# EAGLE design ライン_左 (EAGLE 9.6.2)
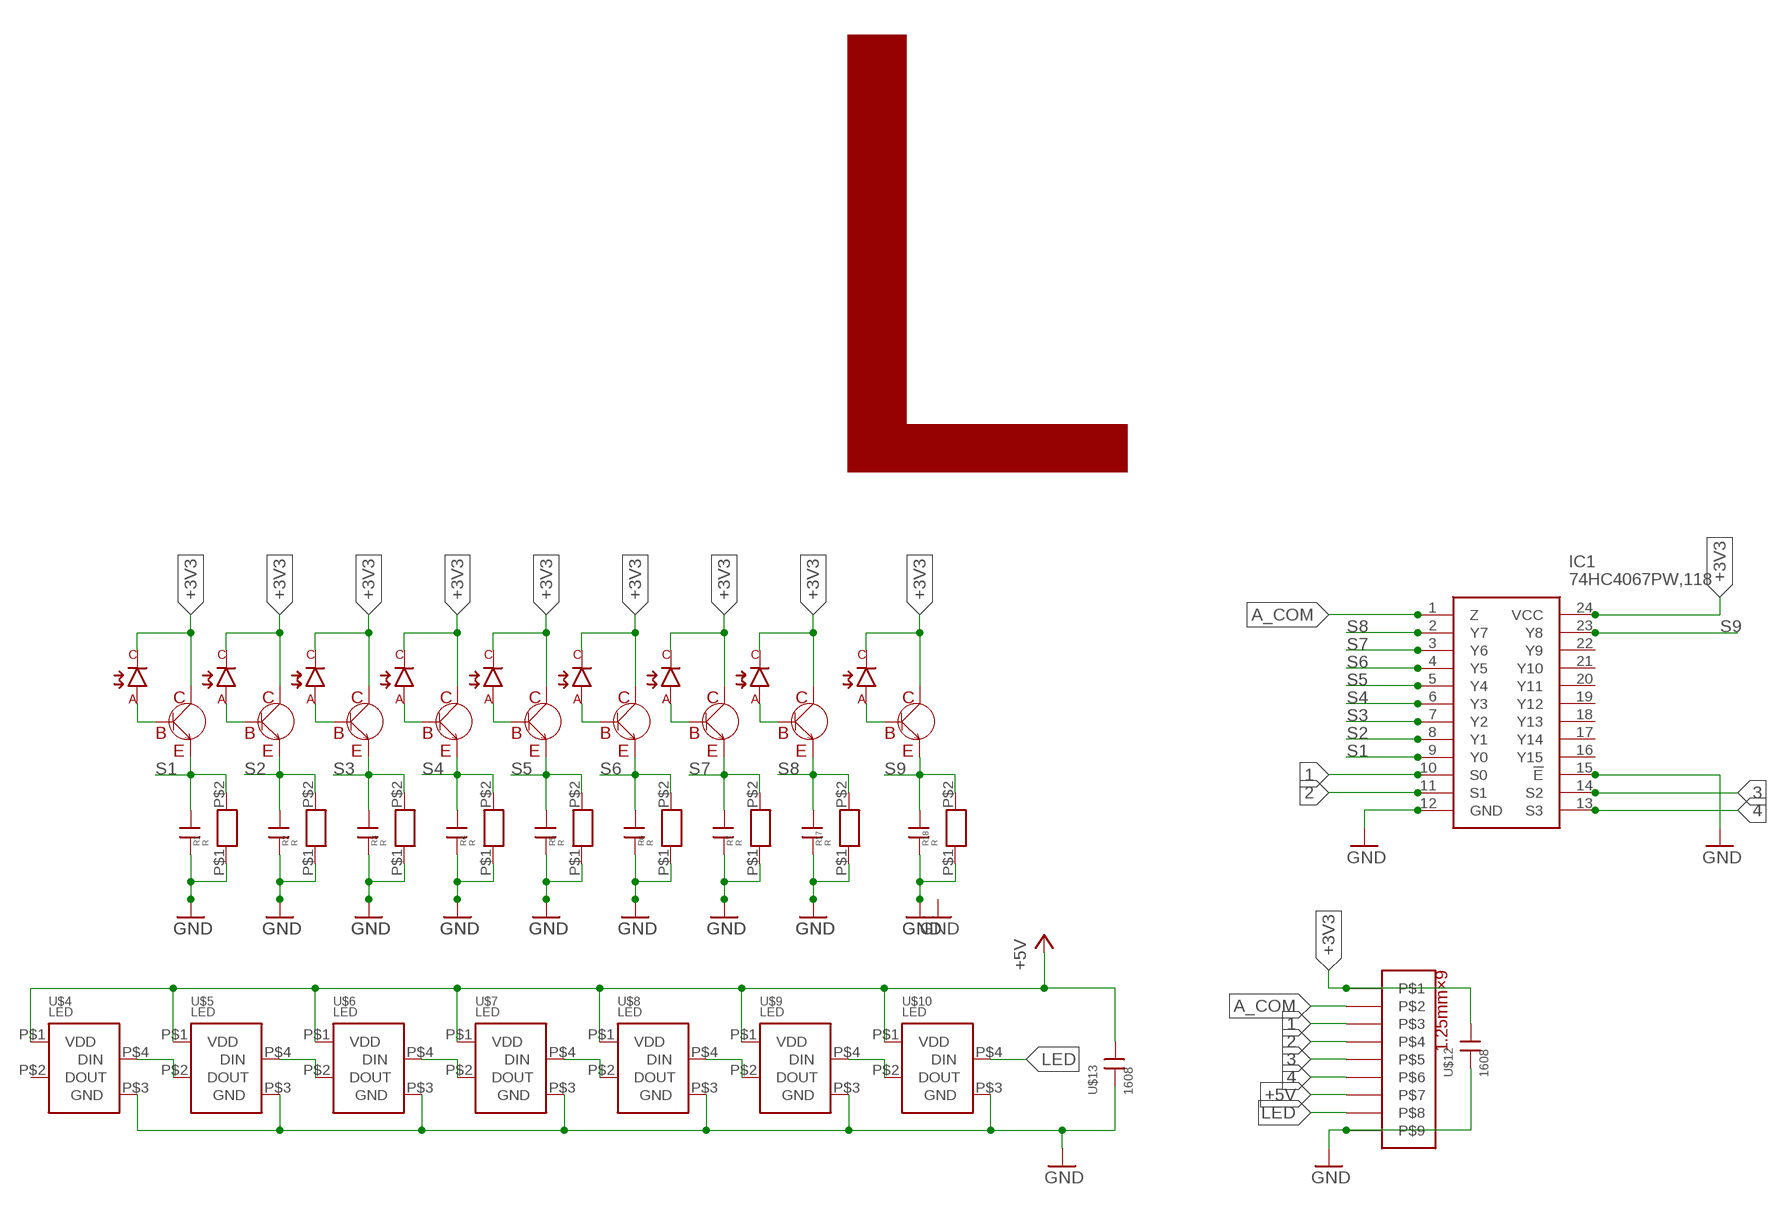
[diagram p0: schematic, sheet 1]

## Parts
C1  1608  [CON]
C2  1608  [CON]
C3  1608  [CON]
C4  1608  [CON]
C5  1608  [CON]
C6  1608  [CON]
C7  1608  [CON]
C17  1608  [CON]
C18  1608  [CON]
IC1  74HC4067PW,118  [SOP65P640X110-24N]
R1  R  [1608]
R2  R  [1608]
R3  R  [1608]
R4  R  [1608]
R5  R  [1608]
R6  R  [1608]
R7  R  [1608]
R17  R  [1608]
R18  R  [1608]
U$4  LED  [LED]
U$5  LED  [LED]
U$6  LED  [LED]
U$7  LED  [LED]
U$8  LED  [LED]
U$9  LED  [LED]
U$10  LED  [LED]
U$11  1MMCON  [1MMCON]
U$12  1608  [CON]
U$13  1608  [CON]
U$14  2CS2712  [TRANS_SSM3J325F,LF]
U$15  フォトダイオード  [フォトダイオード]
U$16  2CS2712  [TRANS_SSM3J325F,LF]
U$17  フォトダイオード  [フォトダイオード]
U$18  2CS2712  [TRANS_SSM3J325F,LF]
U$19  フォトダイオード  [フォトダイオード]
U$20  2CS2712  [TRANS_SSM3J325F,LF]
U$21  フォトダイオード  [フォトダイオード]
U$22  2CS2712  [TRANS_SSM3J325F,LF]
U$23  フォトダイオード  [フォトダイオード]
U$24  2CS2712  [TRANS_SSM3J325F,LF]
U$25  フォトダイオード  [フォトダイオード]
U$26  2CS2712  [TRANS_SSM3J325F,LF]
U$27  フォトダイオード  [フォトダイオード]
U$28  2CS2712  [TRANS_SSM3J325F,LF]
U$29  フォトダイオード  [フォトダイオード]
U$30  2CS2712  [TRANS_SSM3J325F,LF]
U$31  フォトダイオード  [フォトダイオード]

## Nets
1: IC1.10(S0) U$11.P$3
2: IC1.11(S1) U$11.P$4
3: IC1.14(S2) U$11.P$5
4: IC1.13(S3) U$11.P$6
+3V3 [New Class]: IC1.24(VCC) U$11.P$1 U$12.P$1 U$14.C U$15.C U$16.C U$17.C U$18.C U$19.C U$20.C U$21.C U$22.C U$23.C U$24.C U$25.C U$26.C U$27.C U$28.C U$29.C U$30.C U$31.C
+5V [New Class]: U$4.P$1(VDD) U$5.P$1(VDD) U$6.P$1(VDD) U$7.P$1(VDD) U$8.P$1(VDD) U$9.P$1(VDD) U$10.P$1(VDD) U$11.P$7 U$13.P$1
A_COM: IC1.1(Z) U$11.P$2
GND [New Class]: C1.P$2 C2.P$2 C3.P$2 C4.P$2 C5.P$2 C6.P$2 C7.P$2 C17.P$2 C18.P$2 IC1.12(GND) IC1.15(!E) R1.P$1 R2.P$1 R3.P$1 R4.P$1 R5.P$1 R6.P$1 R7.P$1 R17.P$1 R18.P$1 U$4.P$3(GND) U$5.P$3(GND) U$6.P$3(GND) U$7.P$3(GND) U$8.P$3(GND) U$9.P$3(GND) U$10.P$3(GND) U$11.P$9 U$12.P$2 U$13.P$2
LED: U$10.P$4(DIN) U$11.P$8
N$2: U$4.P$4(DIN) U$5.P$2(DOUT)
N$3: U$7.P$4(DIN) U$8.P$2(DOUT)
N$4: U$8.P$4(DIN) U$9.P$2(DOUT)
N$5: U$9.P$4(DIN) U$10.P$2(DOUT)
N$6: U$5.P$4(DIN) U$6.P$2(DOUT)
N$7: U$6.P$4(DIN) U$7.P$2(DOUT)
N$8: U$14.B U$15.A
N$9: U$16.B U$17.A
N$10: U$18.B U$19.A
N$11: U$20.B U$21.A
N$12: U$22.B U$23.A
N$13: U$24.B U$25.A
N$14: U$26.B U$27.A
N$15: U$28.B U$29.A
N$16: U$30.B U$31.A
S1: C1.P$1 IC1.9(Y0) R1.P$2 U$14.E
S2: C2.P$1 IC1.8(Y1) R2.P$2 U$16.E
S3: C3.P$1 IC1.7(Y2) R3.P$2 U$18.E
S4: C4.P$1 IC1.6(Y3) R4.P$2 U$20.E
S5: C5.P$1 IC1.5(Y4) R5.P$2 U$22.E
S6: C6.P$1 IC1.4(Y5) R6.P$2 U$24.E
S7: C7.P$1 IC1.3(Y6) R7.P$2 U$26.E
S8: C17.P$1 IC1.2(Y7) R17.P$2 U$28.E
S9: C18.P$1 IC1.23(Y8) R18.P$2 U$30.E
Unconnected: IC1.16(Y15) IC1.17(Y14) IC1.18(Y13) IC1.19(Y12) IC1.20(Y11) IC1.21(Y10) IC1.22(Y9) U$4.P$2(DOUT)

## Notes on the sheet
- L

## Library data of the parts
C1-C7 C17 C18 U$12 U$13 = con1608:1608
IC1 = 16ch MUX:74HC4067PW,118: 74HC(T)4067 - 16-channel analog multiplexer/demultiplexer@en-us Source: Datasheet <https://assets.nexperia.com/documents/data-sheet/74HC_HCT4067.pdf>; DESCRIPTION: 74HC(T)4067 - 16-channel analog multiplexer/demultiplexer@en-us; HEIGHT: 1.1mm; MANUFACTURER_NAME: Nexperia; MANUFACTURER_PART_NUMBER: 74HC4067PW,118; MOUSER_PART_NUMBER: 771-74HC4067PW-T; MOUSER_PRICE-STOCK: https://www.mouser.co.uk/ProductDetail/Nexperia/74HC4067PW118?qs=P62ublwmbi9BArRi%252BuDUjA%3D%3D
R1-R7 R17 R18 = R 1608:R
U$4-U$10 = フルカラーLED:LED
U$11 = 9P_1.25mmCON:1MMCON
U$14 U$16 U$18 U$20 U$22 U$24 U$26 U$28 U$30 = 2CS2712:2CS2712
U$15 U$17 U$19 U$21 U$23 U$25 U$27 U$29 U$31 = フォトダイオード:フォトダイオード

## Net classes
1 New Class: width 0.254 mm

## Board
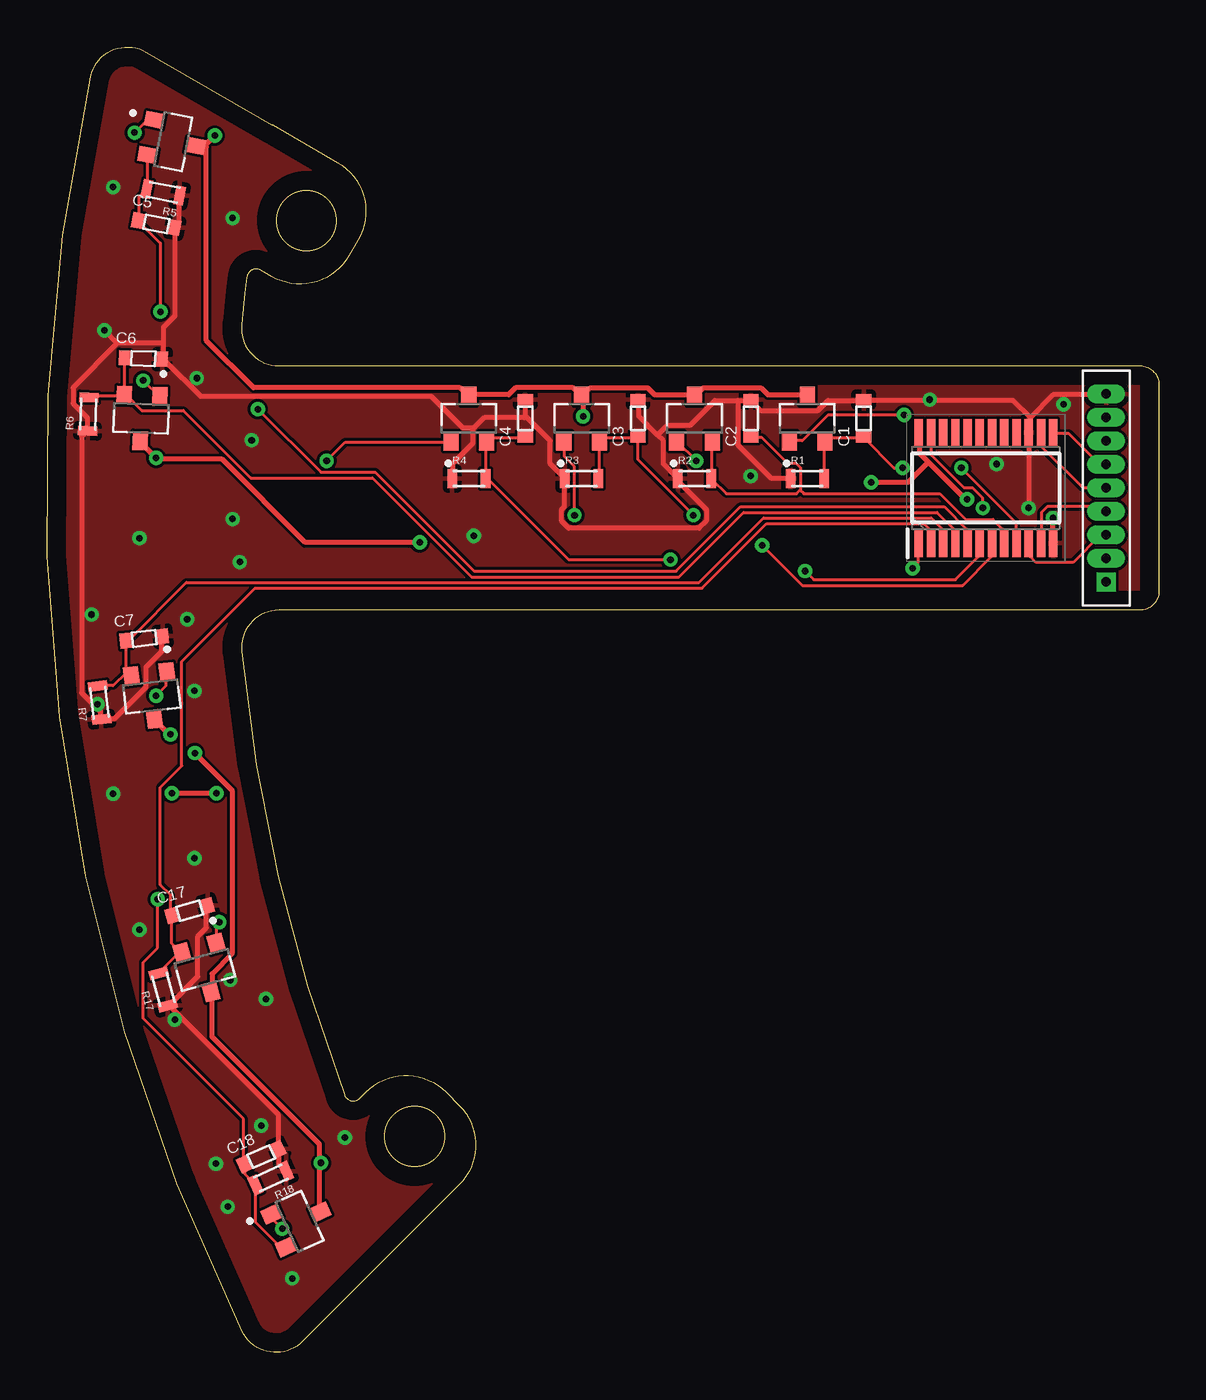
[diagram p1: board, top side]
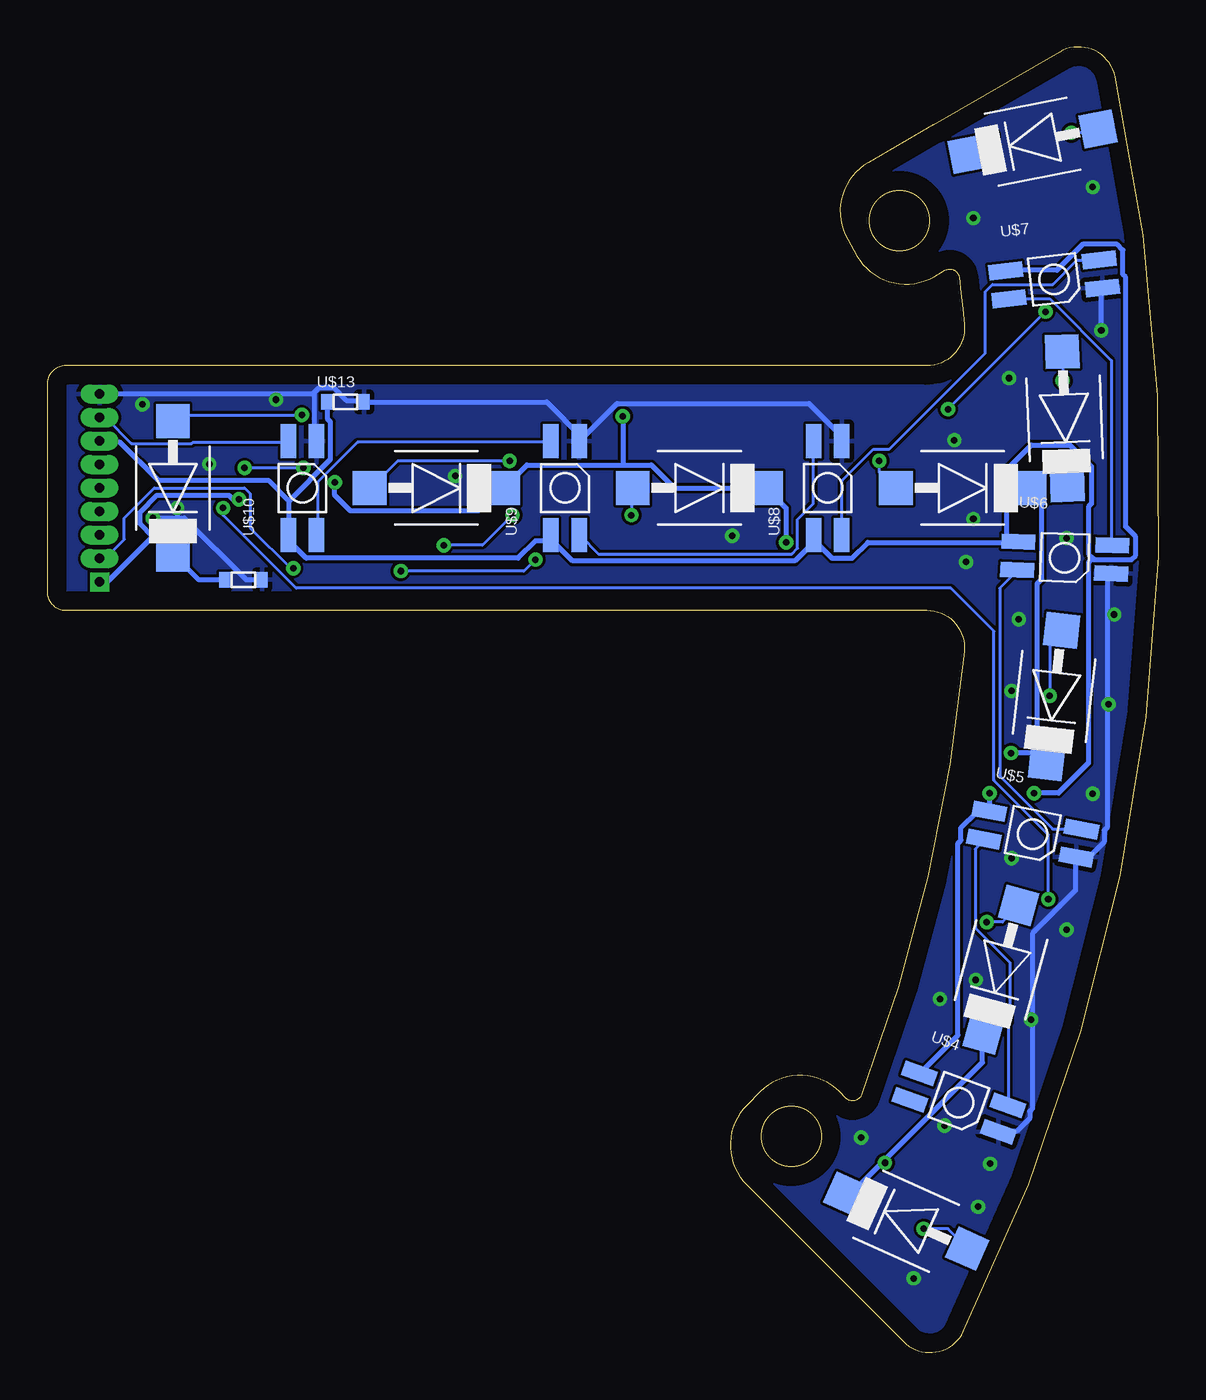
[diagram p2: board, bottom side, seen from below]

Size 59.13 x 69.43 mm. Coordinates in mm from the lower left corner, seen from the top.
Outline: 15.46,63.28 arc-90 16.55,59.18 16.05,58.32 arc-90 11.95,57.22 11.37,57.56 arc113 10.62,57.19 arc2 10.35,54.67 arc95 12.34,52.48 58.13,52.48 arc-90 59.13,51.48 59.13,40.48 arc-90 58.13,39.48 12.34,39.48 arc95 10.35,37.29 arc15 15.82,13.7 arc114 16.64,13.52 16.97,13.86 arc-90 21.21,13.86 21.92,13.15 arc-90 21.92,8.91 13.59,0.59 arc-109 10.39,1.12 arc-39 2.32,67.86 arc-108 5.28,69.16 11.99,65.28 arc0 11.99,65.28 15.46,63.28
Outline: circle at 13.79,60.2 radius 1.6
Outline: circle at 19.55,11.49 radius 1.6
Copper layers (1*16): Top 0.035mm / dielectric 1.5mm / Bottom 0.035mm
Design rules "default": minimum track width 6mil, minimum drill 0.35mm, track to track 6mil, track to pad 6mil, pad to pad 6mil, via to via 6mil, smd to smd 6mil, copper to edge 40mil, drill to drill 6mil, minimum pad ring 10mil, minimum via ring 8mil, stop-mask expansion 4mil, vias tented up to drill 0mil, thermal gap 10mil

### Footprints (pad centres in the part's own frame; a part is rotated, then mirrored left to right if it is on the bottom)
CON = smd 0.6 x 0.813: P$1 -1,0; P$2 1,0
SOP65P640X110-24N = smd 1.475 x 0.45: 1 -2.938,3.575; 2 -2.938,2.925; 3 -2.938,2.275; 4 -2.938,1.625; 5 -2.938,0.975; 6 -2.938,0.325; 7 -2.938,-0.325; 8 -2.938,-0.975; 9 -2.938,-1.625; 10 -2.938,-2.275; 11 -2.938,-2.925; 12 -2.938,-3.575; 13 2.938,-3.575; 14 2.938,-2.925; 15 2.938,-2.275; 16 2.938,-1.625; 17 2.938,-0.975; 18 2.938,-0.325; 19 2.938,0.325; 20 2.938,0.975; 21 2.938,1.625; 22 2.938,2.275; 23 2.938,2.925; 24 2.938,3.575
1608 = smd 0.508 x 1.016: P$1 -0.889,0; P$2 0.889,0
LED = smd 1.8 x 0.82: P$1 -2.5,0.75; P$2 -2.5,-0.75; P$3 2.5,-0.75; P$4 2.5,0.75
1MMCON = drill 0.5 square: P$1 0,0 | drill 0.5 long: P$2 1.25,0; P$3 2.5,0; P$4 3.75,0; P$5 5,0; P$6 6.25,0; P$7 7.5,0; P$8 8.75,0; P$9 10,0
TRANS_SSM3J325F,LF = smd 1 x 0.8: B -1.2,0.95; C 1.2,0; E -1.2,-0.95
フォトダイオード = smd 1.8 x 1.8: A -3.55,0; C 3.55,0

### Placement (x,y rotation side)
C1  43.43,49.68 90 top
C2  37.43,49.68 90 top
C3  31.43,49.68 90 top
C4  25.43,49.68 90 top
C5  5.82,60.01 349 top
C6  5.12,52.86 357.8 top
C7  5.17,37.98 6.6 top
C17  7.58,23.5 15.4 top
C18  11.39,10.42 24.2 top
IC1  49.93,45.98 90 top
R1  40.43,46.48 0 top
R2  34.43,46.48 0 top
R3  28.43,46.48 0 top
R4  22.43,46.48 0 top
R5  6.18,61.7 169 top
R6  2.2,49.9 87.8 top
R7  2.79,34.56 96.6 top
R17  6.18,19.31 105.4 top
R18  11.9,9.27 204.2 top
U$4  10.64,13.29 340.2 bottom
U$5  6.71,27.56 349 bottom
U$6  5.01,42.27 357.8 bottom
U$7  5.57,57.07 6.6 bottom
U$8  17.61,45.98 90 bottom
U$9  31.58,45.98 90 bottom
U$10  45.55,45.98 90 bottom
U$11  56.33,40.98 90 top
U$12  48.69,41.1 0 bottom
U$13  43.27,50.56 0 bottom
U$14  40.43,49.68 90 top
U$15  52.43,45.98 270 bottom
U$16  34.43,49.68 90 top
U$17  38.43,45.98 0 bottom
U$18  28.43,49.68 90 top
U$19  24.43,45.98 0 bottom
U$20  22.43,49.68 90 top
U$21  10.43,45.98 0 bottom
U$22  6.72,64.39 349 top
U$23  6.72,64.39 191 bottom
U$24  5.01,49.68 267.8 top
U$25  5.01,49.68 272.2 bottom
U$26  5.57,34.89 276.6 top
U$27  5.57,34.89 263.4 bottom
U$28  8.4,20.35 285.4 top
U$29  8.4,20.35 254.6 bottom
U$30  13.43,6.98 24.2 top
U$31  13.43,6.98 155.8 bottom

### Tracks (layer width: path | path; a pad name or v marks a point on that pad's centre or on a via)
1
  Top 0.152: IC1.10 52.29,43.01 52.29,42.32 52.59,42.02 54.57,42.02 56.02,43.46 56.32,43.46 U$11.P$3
2
  Top 0.152: IC1.11 52.9,43.08 52.9,44.68 53.2,44.99 56.1,44.99 56.32,44.76 U$11.P$4
3
  Top 0.152: U$11.P$5 55.1,45.98 52.9,48.19 52.9,48.87 IC1.14
4
  Top 0.152: IC1.13 53.58,48.87 54.34,48.87 55.94,47.27 56.32,47.27 U$11.P$6
+3V3  (via drill 0.35)
  Top 0.254: 14.49,10.09 14.49,7.5 U$30.C | 14.49,10.09 14.49,11.08 8.78,16.79 8.78,19.16 U$28.C 8.78,19.31 8.78,20.15 9.84,21.21 9.84,29.9 v7.86,31.88 | v14.57,10.09 14.49,10.09 | v6.57,32.87 6.49,32.87 5.73,33.63 U$26.C | U$24.C 4.97,48.42 v5.8,47.58 5.88,47.5 9.31,47.5 13.73,43.08 v19.82,43.08 | 46.88,47.35 48.86,45.37 v48.93,45.37 | 46.88,47.35 46.42,47.81 46.42,48.87 IC1.24 | 8.39,64.19 7.94,64.19 U$22.C | v8.93,64.72 8.39,64.19 | U$18.C 28.36,50.93 27.98,51.31 24.93,51.31 24.55,50.93 22.49,50.93 U$20.C 22.34,50.93 21.96,51.31 10.99,51.31 8.47,53.83 8.47,64.11 8.39,64.19 | U$18.C 28.51,50.93 28.89,51.31 31.94,51.31 32.32,50.93 34.38,50.93 U$16.C 34.53,50.93 34.91,51.31 37.96,51.31 38.34,50.93 40.4,50.93 U$14.C | v28.51,49.79 28.51,50.78 U$18.C | 46.88,47.35 45.81,46.28 v43.83,46.28
  Bottom 0.254: 14.64,10.16 16.32,8.49 16.62,8.49 U$31.C | 14.64,10.16 9.38,15.42 9.38,16.87 U$29.C | v14.57,10.09 14.64,10.16 | 5.8,47.12 v5.8,47.58 | 5.8,47.12 4.89,46.21 U$25.C | 5.8,47.12 5.8,47.04 6.87,45.98 U$21.C 6.79,45.9 6.26,45.37 6.26,41.1 6.49,40.87 6.49,32.95 v6.57,32.87 6.57,31.96 6.03,31.42 U$27.C 6.64,31.88 v7.86,31.88 | U$12.P$1 51.07,41.1 52.36,42.4 U$15.C 52.51,42.4 53.5,43.39 | v48.93,45.37 49.24,45.37 49.47,45.6 53.28,45.6 54.19,44.68 54.19,44.07 53.5,43.39 | 53.5,43.39 55.87,41.02 56.32,41.02 U$11.P$1 | 28.51,47.2 33.62,47.2 34.84,45.98 U$17.C 34.99,45.98 36.21,44.76 42.99,44.76 43.83,45.6 v43.83,46.28 | 28.51,47.2 26.99,47.2 25.77,45.98 U$19.C 20.81,45.9 19.82,44.91 v19.82,43.08 | v8.93,64.72 9.16,64.72 10.15,63.73 U$23.C | v28.51,49.79 28.51,47.2
+5V  (via drill 0.35)
  Top 0.254: v6.64,29.75 v9,29.75
  Bottom 0.254: 46.27,45.29 44.06,47.5 44.06,49.48 44.21,49.64 44.21,50.55 U$13.P$1 | 46.27,45.29 46.27,43.54 U$10.P$1 46.27,43.39 46.27,43.16 45.35,42.24 34.07,42.24 33.16,43.16 32.4,43.16 U$9.P$1 32.32,43.46 32.32,43.23 31.18,42.09 19.37,42.09 18.38,43.08 U$8.P$1 18.3,43.46 18.3,43.16 17.39,42.24 16.32,42.24 15.48,43.08 7.48,43.08 U$6.P$1 8.09,43.16 8.09,46.97 6.79,48.26 4.74,48.26 3.59,47.12 3.59,45.14 3.75,44.99 3.75,42.47 3.52,42.24 | 46.27,45.29 47.33,46.36 53.2,46.36 55.26,48.42 56.32,48.42 U$11.P$7 | U$4.P$1 12.66,14.89 10.68,16.87 10.68,27.08 10.53,27.23 10.53,27.92 9.69,28.76 9.08,28.76 U$5.P$1 9,28.91 v9,29.75 | 3.52,42.24 3.44,42.17 1.46,42.17 1.23,42.4 1.23,43.39 1.76,43.92 1.76,57.18 1.92,57.33 1.92,58.63 2.22,58.93 4.05,58.93 5.42,57.56 8.09,57.56 U$7.P$1 | v6.64,29.75 5.35,29.75 3.75,31.35 3.75,42.02 3.52,42.24
A_COM  (via drill 0.35)
  Top 0.152: v46.04,41.71 46.34,42.02 46.34,43.01 IC1.1
  Bottom 0.152: v46.04,41.71 46.19,41.71 48.32,43.84 48.32,45.67 48.63,45.98 53.43,45.98 55.03,44.38 55.03,43.23 56.02,42.24 56.32,42.24 U$11.P$2
GND  (via drill 0.35)
  Top 0.254: 25.46,49.79 25.46,50.63 C4.P$2 | 25.46,49.79 26.76,48.49 26.76,47.27 27.52,46.51 R3.P$1 27.52,46.36 27.52,44.99 27.37,44.83 27.37,44.22 27.75,43.84 34.68,43.84 35.06,44.22 35.06,44.83 33.54,46.36 R2.P$1 33.54,46.51 32.78,47.27 32.78,48.49 32.47,48.8 | 22.64,49.1 22.64,48.34 21.58,47.27 21.58,46.51 R4.P$1 | 22.64,49.1 23.25,49.71 25.39,49.71 25.46,49.79 | 32.47,48.8 31.48,49.79 31.48,50.63 C3.P$2 | 36.74,50.63 35.52,50.63 34.23,49.33 33.01,49.33 32.47,48.8 | 36.74,50.63 37.43,50.63 C2.P$2 37.5,50.55 37.96,50.09 41.01,50.09 41.54,50.63 43.37,50.63 C1.P$2 43.52,50.63 51.37,50.63 52.29,49.71 | 36.74,50.63 36.74,48.26 38.49,46.51 39.48,46.51 R1.P$1 | v53.5,44.38 53.5,43.08 IC1.12 | 52.29,49.71 52.29,48.95 IC1.15 52.21,48.8 v52.21,44.91 | 52.29,49.71 53.5,50.93 56.32,50.93 U$11.P$9 | C7.P$2 6.11,38.05 6.11,37.29 5.27,36.45 5.27,35.39 3.59,33.71 2.91,33.71 R7.P$1 2.83,33.79 2.83,34.09 2.53,34.4 | 6.18,53.67 6.18,54.51 6.79,55.12 6.79,59.77 C5.P$2 6.87,59.92 7.02,60.07 7.02,61.52 R5.P$1 | 6.18,53.67 6.18,52.84 C6.P$2 6.26,52.76 8.17,50.85 20.43,50.85 22.11,49.18 22.57,49.18 22.64,49.1 | 3.75,53.67 1.38,51.31 1.38,50.47 2.15,49.71 2.15,49.03 R6.P$1 2.07,48.95 1.84,48.72 1.84,35.08 2.53,34.4 | 6.18,53.67 3.75,53.67 | 3.75,53.67 v3.06,54.36 | R18.P$1 12.66,9.71 12.36,10.01 12.36,10.77 C18.P$2 12.28,10.93 12.28,12.68 7.02,17.94 | C17.P$2 8.47,23.73 8.47,22.58 8.01,22.13 8.01,19.99 6.49,18.47 R17.P$1 6.57,18.39 7.02,17.94 | v6.79,17.71 7.02,17.94 | v2.68,34.47 2.6,34.47 2.53,34.4
  Bottom 0.254: U$8.P$3 16.93,48.49 16.93,48.8 18.61,50.47 28.82,50.47 30.8,48.49 U$9.P$3 30.72,48.72 32.55,50.55 42.15,50.55 U$13.P$2 42.3,50.63 43.22,50.63 43.9,51.31 44.67,51.31 44.89,51.08 | v53.5,44.38 52.21,44.38 | 52.21,44.38 51.83,44.38 48.55,41.1 47.71,41.1 U$12.P$2 | 44.89,51.08 44.89,48.57 44.82,48.49 U$10.P$3 | 44.89,51.08 44.97,51.01 56.32,51.01 U$11.P$9 | v52.21,44.91 52.21,44.38 | v3.06,54.36 3.06,56.57 U$7.P$3 | 2.76,34.47 2.76,41.25 2.6,41.41 U$6.P$3 | 2.76,34.47 2.76,27.92 2.91,27.77 2.91,27.16 3.67,26.39 4.36,26.39 U$5.P$3 4.43,26.24 4.43,24.57 6.72,22.28 6.72,17.71 | 6.72,17.71 6.72,12.98 6.87,12.83 6.87,12.45 7.56,11.76 8.47,11.76 U$4.P$3 | v6.79,17.71 6.72,17.71 | v2.68,34.47 2.76,34.47
  other vias: 22.69,43.44 37.43,46.61 50.51,47.25 54.06,50.42 46.95,50.68 10.25,42.04 4.91,43.31 9.87,44.33 10.88,48.52 7.96,51.82 2.37,39.25 7.45,38.99 7.84,35.18 9.87,60.33 3.52,61.98 3.52,29.72 7.84,26.29 4.91,22.48 11.65,18.8 9.74,19.82 8.98,10.04 15.84,11.43 13.04,3.94 9.61,7.75 11.39,12.07
  pour Top: -10.33,73.92 -10.33,-4.82 68.41,-4.82 68.41,73.92
  pour Bottom: -10.33,73.92 -10.33,-4.82 68.41,-4.82 68.41,73.92
LED
  Bottom 0.152: U$10.P$4 46.34,48.42 51.37,48.42 51.45,48.34 54.65,48.34 56.02,49.71 56.32,49.71 U$11.P$8
N$2
  Bottom 0.152: U$4.P$4 8.01,13.21 8.01,17.48 7.94,17.55 7.94,20.76 9.77,22.58 9.77,26.78 9.31,27.23 U$5.P$2
N$3
  Bottom 0.152: U$7.P$4 3.21,58.09 4.36,58.09 5.65,56.8 8.85,56.8 9.23,56.42 9.23,53.14 14.34,48.03 15.18,48.03 16.85,46.36 16.85,43.54 U$8.P$2
N$4
  Bottom 0.152: U$8.P$4 18.38,48.42 18.38,45.14 19.21,44.3 19.21,42.78 19.52,42.47 29.81,42.47 30.8,43.46 U$9.P$2
N$5
  Bottom 0.152: U$10.P$2 44.74,43.54 44.74,46.28 42.61,48.42 32.4,48.42 U$9.P$4
N$6
  Bottom 0.152: U$5.P$4 4.13,27.84 5.65,27.84 8.47,30.66 8.47,40.64 7.56,41.56 U$6.P$2
N$7
  Bottom 0.152: U$6.P$4 2.53,42.93 2.53,52.76 5.8,56.04 7.94,56.04 U$7.P$2
N$8  (via drill 0.35)
  Top 0.152: v45.58,49.86 41.54,49.86 40.17,48.49 39.56,48.49 U$14.B
  Bottom 0.152: v45.58,49.86 52.06,49.86 52.36,49.56 U$15.A
N$9  (via drill 0.35)
  Top 0.152: v34.53,47.43 33.54,48.42 U$16.B
  Bottom 0.152: v34.53,47.43 40.47,47.43 41.92,45.98 U$17.A
N$10  (via drill 0.35)
  Top 0.152: v28.05,44.53 28.05,47.12 27.52,47.65 27.52,48.42 U$18.B
  Bottom 0.152: v28.05,44.53 28.05,45.98 U$19.A
N$11  (via drill 0.35)
  Top 0.152: v14.87,47.43 15.86,48.42 21.42,48.42 U$20.B
  Bottom 0.152: v14.87,47.43 14.87,46.82 14.03,45.98 U$21.A
N$12  (via drill 0.35)
  Top 0.152: v4.66,64.88 5.27,65.48 5.65,65.48 U$22.B
  Bottom 0.152: v4.66,64.88 3.44,64.88 3.29,65.03 U$23.A
N$13  (via drill 0.35)
  Top 0.152: v5.12,51.69 5.96,50.85 U$24.B
  Bottom 0.152: v5.12,51.69 5.12,53.22 U$25.A
N$14  (via drill 0.35)
  Top 0.152: v5.8,34.93 6.34,35.46 6.34,36.15 U$26.B
  Bottom 0.152: v5.8,34.93 5.8,37.75 5.19,38.36 U$27.A
N$15  (via drill 0.35)
  Top 0.152: v9.16,22.89 9,22.74 9,21.82 U$28.B
  Bottom 0.152: v9.16,22.89 8.32,22.89 7.48,23.73 U$29.A
N$16  (via drill 0.35)
  Top 0.152: v12.51,6.58 11.98,7.12 11.98,7.34 U$30.B
  Bottom 0.152: v12.51,6.58 11.21,6.58 10.22,5.59 U$31.A
S1  (via drill 0.35)
  Top 0.152: R1.P$2 41.31,46.51 41.31,48.42 U$14.E 41.39,48.49 41.54,48.64 43.37,48.64 C1.P$1 43.45,48.64 45.05,47.04 v45.5,47.04 | v48.63,47.04 51.52,44.15 51.52,43.08 IC1.9
  Bottom 0.152: v45.5,47.04 v48.63,47.04
S2
  Top 0.152: 40.06,45.86 39.86,45.67 36.13,45.67 35.37,46.43 R2.P$2 35.37,46.51 35.37,48.42 U$16.E | 40.06,45.86 40.09,45.9 40.09,47.04 39.86,47.27 39.41,47.27 38.04,48.64 37.5,48.64 C2.P$1 | 40.06,45.86 40.25,45.67 47.48,45.67 48.86,44.3 50.3,44.3 50.84,43.77 50.84,43.08 IC1.8
S3  (via drill 0.35)
  Top 0.152: R3.P$2 29.35,46.51 29.35,48.42 U$18.E 29.43,48.49 29.58,48.64 31.41,48.64 C3.P$1 31.41,48.57 31.41,47.5 v34.38,44.53 | v38.04,42.93 40.17,40.8 48.7,40.8 50.23,42.32 50.23,43.01 IC1.7
  Bottom 0.152: v38.04,42.93 35.98,42.93 v34.38,44.53
S4  (via drill 0.35)
  Top 0.152: C4.P$1 25.39,48.64 23.56,48.64 23.41,48.49 U$20.E 23.33,48.42 23.33,46.51 R4.P$2 23.41,46.51 27.75,42.17 v33.16,42.17 | v40.32,41.56 40.78,41.1 48.32,41.1 49.54,42.32 49.54,43.01 IC1.6
  Bottom 0.152: v40.32,41.56 33.77,41.56 v33.16,42.17
S5  (via drill 0.35)
  Top 0.152: U$22.E 5.35,63.66 5.35,61.9 R5.P$2 5.27,61.83 4.89,61.45 4.89,60.23 C5.P$1 4.89,60.15 6.03,59.01 v6.03,55.35 | v11.21,50.17 14.57,46.82 17.46,46.82 22.72,41.56 33.46,41.56 36.89,44.99 47.71,44.99 48.93,43.77 48.93,43.08 IC1.5
  Bottom 0.152: v6.03,55.35 v11.21,50.17
S6
  Top 0.152: C6.P$1 4.13,52.84 4.13,50.93 U$24.E | R6.P$2 2.3,50.85 4.05,50.85 U$24.E | IC1.4 48.25,43.08 48.25,43.77 47.33,44.68 37.05,44.68 33.62,41.25 22.57,41.25 17.31,46.51 10.83,46.51 7.25,50.09 5.04,50.09 4.2,50.93 U$24.E
S7
  Top 0.152: R7.P$2 2.76,35.46 3.52,35.46 4.2,36.15 U$26.E 4.43,36 4.2,36.22 4.2,37.82 C7.P$1 4.28,37.82 7.4,40.95 34.68,40.95 38.11,44.38 47.03,44.38 47.64,43.77 47.64,43.08 IC1.3
S8
  Top 0.152: R17.P$2 5.96,20.22 7.02,21.29 U$28.E 7.1,21.29 6.64,21.75 6.64,23.19 C17.P$1 6.57,23.27 6.57,24.34 6.03,24.87 6.03,30.05 7.18,31.19 7.18,36.76 11.06,40.64 34.84,40.64 38.26,44.07 46.65,44.07 46.95,43.77 46.95,43.08 IC1.2
S9  (via drill 0.35)
  Top 0.152: U$30.E 12.66,5.67 12.36,5.67 11.06,6.96 11.06,8.87 R18.P$2 11.06,8.94 10.53,9.48 10.53,9.93 C18.P$1 10.45,10.01 10.45,12.42 5.12,17.76 5.12,20.76 5.88,21.52 v5.88,24.11 | v49.77,44.91 49.77,45.44 49.24,45.98 48.78,45.98 47.03,47.73 47.03,48.87 IC1.23
  Bottom 0.152: v49.77,44.91 49.77,44.53 45.88,40.64 11.06,40.64 8.78,38.36 8.78,30.43 5.88,27.54 v5.88,24.11